# Altium project PCB_Project2.PrjPCB
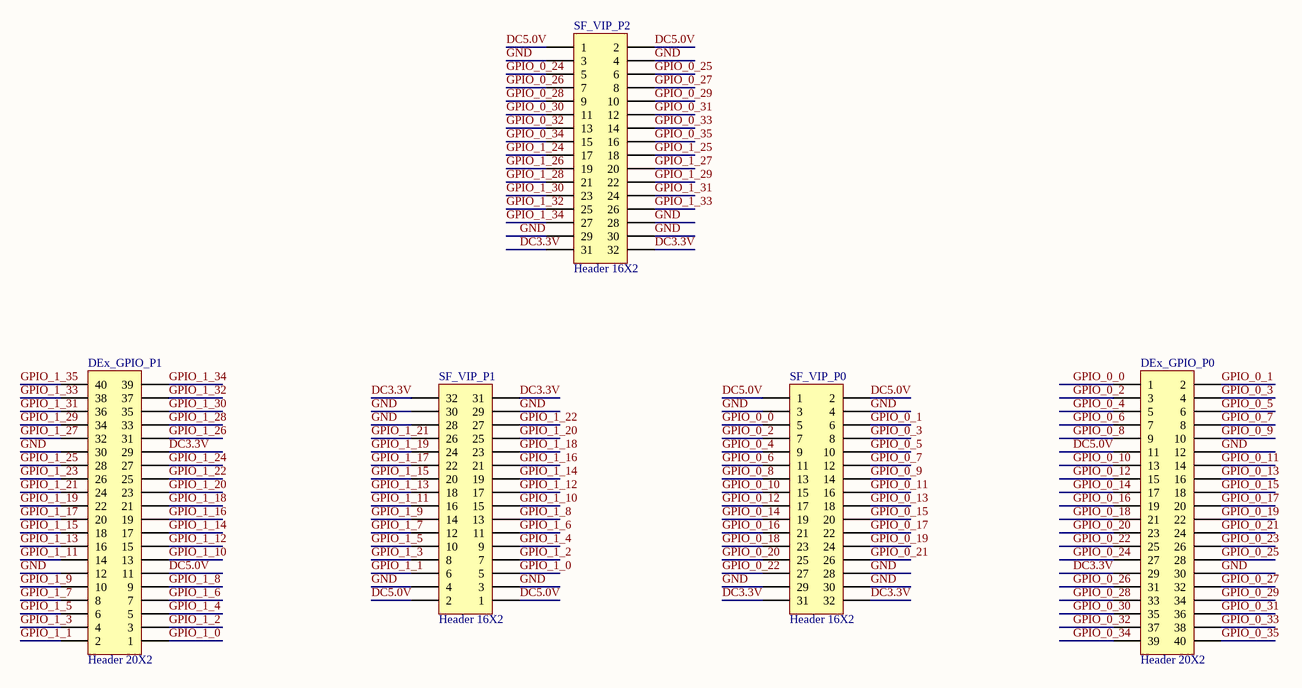
[diagram p0: Sheet1.SchDoc]
1 sheet, 5 parts. Net scope: global (net labels, ports and power ports of the same name join across sheets).
Board file: PCB1.PcbDoc

## Sheet Sheet1.SchDoc
size A4

### Parts
DEx_GPIO_P0  Header 20X2  [HDR2X20]
DEx_GPIO_P1  Header 20X2  [HDR2X20]
SF_VIP_P0  Header 16X2  [HDR2X16]
SF_VIP_P1  Header 16X2  [HDR2X16]
SF_VIP_P2  Header 16X2  [HDR2X16]

### Nets
DC3.3V: DEx_GPIO_P0.29 DEx_GPIO_P1.29 SF_VIP_P0.31 SF_VIP_P0.32 SF_VIP_P1.31 SF_VIP_P1.32 SF_VIP_P2.31 SF_VIP_P2.32
DC5.0V: DEx_GPIO_P0.11 DEx_GPIO_P1.11 SF_VIP_P0.1 SF_VIP_P0.2 SF_VIP_P1.1 SF_VIP_P1.2 SF_VIP_P2.1 SF_VIP_P2.2
GND: DEx_GPIO_P0.12 DEx_GPIO_P0.30 DEx_GPIO_P1.12 DEx_GPIO_P1.30 SF_VIP_P0.3 SF_VIP_P0.4 SF_VIP_P0.28 SF_VIP_P0.29 SF_VIP_P0.30 SF_VIP_P1.3 SF_VIP_P1.4 SF_VIP_P1.28 SF_VIP_P1.29 SF_VIP_P1.30 SF_VIP_P2.3 SF_VIP_P2.4 SF_VIP_P2.28 SF_VIP_P2.29 SF_VIP_P2.30
GPIO_0_0: DEx_GPIO_P0.1 SF_VIP_P0.5
GPIO_0_1: DEx_GPIO_P0.2 SF_VIP_P0.6
GPIO_0_2: DEx_GPIO_P0.3 SF_VIP_P0.7
GPIO_0_3: DEx_GPIO_P0.4 SF_VIP_P0.8
GPIO_0_4: DEx_GPIO_P0.5 SF_VIP_P0.9
GPIO_0_5: DEx_GPIO_P0.6 SF_VIP_P0.10
GPIO_0_6: DEx_GPIO_P0.7 SF_VIP_P0.11
GPIO_0_7: DEx_GPIO_P0.8 SF_VIP_P0.12
GPIO_0_8: DEx_GPIO_P0.9 SF_VIP_P0.13
GPIO_0_9: DEx_GPIO_P0.10 SF_VIP_P0.14
GPIO_0_10: DEx_GPIO_P0.13 SF_VIP_P0.15
GPIO_0_11: DEx_GPIO_P0.14 SF_VIP_P0.16
GPIO_0_12: DEx_GPIO_P0.15 SF_VIP_P0.17
GPIO_0_13: DEx_GPIO_P0.16 SF_VIP_P0.18
GPIO_0_14: DEx_GPIO_P0.17 SF_VIP_P0.19
GPIO_0_15: DEx_GPIO_P0.18 SF_VIP_P0.20
GPIO_0_16: DEx_GPIO_P0.19 SF_VIP_P0.21
GPIO_0_17: DEx_GPIO_P0.20 SF_VIP_P0.22
GPIO_0_18: DEx_GPIO_P0.21 SF_VIP_P0.23
GPIO_0_19: DEx_GPIO_P0.22 SF_VIP_P0.24
GPIO_0_20: DEx_GPIO_P0.23 SF_VIP_P0.25
GPIO_0_21: DEx_GPIO_P0.24 SF_VIP_P0.26
GPIO_0_22: DEx_GPIO_P0.25 SF_VIP_P0.27
GPIO_0_23: DEx_GPIO_P0.26
GPIO_0_24: DEx_GPIO_P0.27 SF_VIP_P2.5
GPIO_0_25: DEx_GPIO_P0.28 SF_VIP_P2.6
GPIO_0_26: DEx_GPIO_P0.31 SF_VIP_P2.7
GPIO_0_27: DEx_GPIO_P0.32 SF_VIP_P2.8
GPIO_0_28: DEx_GPIO_P0.33 SF_VIP_P2.9
GPIO_0_29: DEx_GPIO_P0.34 SF_VIP_P2.10
GPIO_0_30: DEx_GPIO_P0.35 SF_VIP_P2.11
GPIO_0_31: DEx_GPIO_P0.36 SF_VIP_P2.12
GPIO_0_32: DEx_GPIO_P0.37 SF_VIP_P2.13
GPIO_0_33: DEx_GPIO_P0.38 SF_VIP_P2.14
GPIO_0_34: DEx_GPIO_P0.39 SF_VIP_P2.15
GPIO_0_35: DEx_GPIO_P0.40 SF_VIP_P2.16
GPIO_1_0: DEx_GPIO_P1.1 SF_VIP_P1.5
GPIO_1_1: DEx_GPIO_P1.2 SF_VIP_P1.6
GPIO_1_2: DEx_GPIO_P1.3 SF_VIP_P1.7
GPIO_1_3: DEx_GPIO_P1.4 SF_VIP_P1.8
GPIO_1_4: DEx_GPIO_P1.5 SF_VIP_P1.9
GPIO_1_5: DEx_GPIO_P1.6 SF_VIP_P1.10
GPIO_1_6: DEx_GPIO_P1.7 SF_VIP_P1.11
GPIO_1_7: DEx_GPIO_P1.8 SF_VIP_P1.12
GPIO_1_8: DEx_GPIO_P1.9 SF_VIP_P1.13
GPIO_1_9: DEx_GPIO_P1.10 SF_VIP_P1.14
GPIO_1_10: DEx_GPIO_P1.13 SF_VIP_P1.15
GPIO_1_11: DEx_GPIO_P1.14 SF_VIP_P1.16
GPIO_1_12: DEx_GPIO_P1.15 SF_VIP_P1.17
GPIO_1_13: DEx_GPIO_P1.16 SF_VIP_P1.18
GPIO_1_14: DEx_GPIO_P1.17 SF_VIP_P1.19
GPIO_1_15: DEx_GPIO_P1.18 SF_VIP_P1.20
GPIO_1_16: DEx_GPIO_P1.19 SF_VIP_P1.21
GPIO_1_17: DEx_GPIO_P1.20 SF_VIP_P1.22
GPIO_1_18: DEx_GPIO_P1.21 SF_VIP_P1.23
GPIO_1_19: DEx_GPIO_P1.22 SF_VIP_P1.24
GPIO_1_20: DEx_GPIO_P1.23 SF_VIP_P1.25
GPIO_1_21: DEx_GPIO_P1.24 SF_VIP_P1.26
GPIO_1_22: DEx_GPIO_P1.25 SF_VIP_P1.27
GPIO_1_23: DEx_GPIO_P1.26
GPIO_1_24: DEx_GPIO_P1.27 SF_VIP_P2.17
GPIO_1_25: DEx_GPIO_P1.28 SF_VIP_P2.18
GPIO_1_26: DEx_GPIO_P1.31 SF_VIP_P2.19
GPIO_1_27: DEx_GPIO_P1.32 SF_VIP_P2.20
GPIO_1_28: DEx_GPIO_P1.33 SF_VIP_P2.21
GPIO_1_29: DEx_GPIO_P1.34 SF_VIP_P2.22
GPIO_1_30: DEx_GPIO_P1.35 SF_VIP_P2.23
GPIO_1_31: DEx_GPIO_P1.36 SF_VIP_P2.24
GPIO_1_32: DEx_GPIO_P1.37 SF_VIP_P2.25
GPIO_1_33: DEx_GPIO_P1.38 SF_VIP_P2.26
GPIO_1_34: DEx_GPIO_P1.39 SF_VIP_P2.27
GPIO_1_35: DEx_GPIO_P1.40

### Library data of the parts
DEx_GPIO_P0 DEx_GPIO_P1 = Header 20X2: Header, 20-Pin, Dual row; LatestRevisionDate: 17-Jul-2002; LatestRevisionNote: Re-released for DXP Platform.; Publisher: Altium Limited
SF_VIP_P0-SF_VIP_P2 = Header 16X2: Header, 16-Pin, Dual row; LatestRevisionDate: 17-Jul-2002; LatestRevisionNote: Re-released for DXP Platform.; Publisher: Altium Limited